# Altium schematic sheet Sheet1.SchDoc
size A4
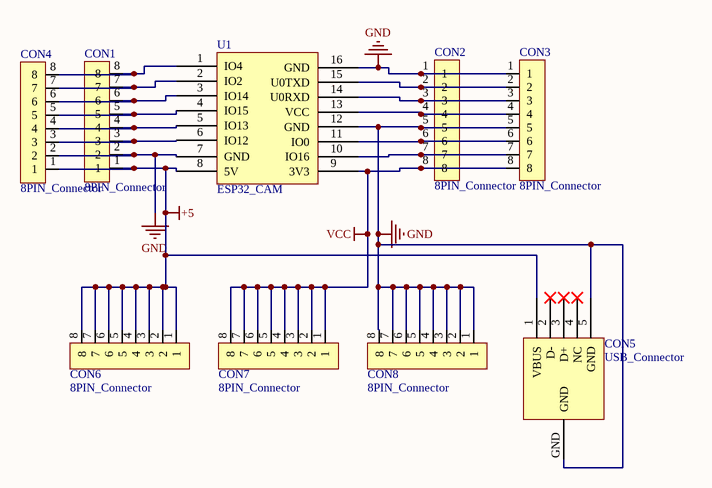
[diagram p0: Sheet1.SchDoc]

## Parts
CON1  8PIN_Connector  [8PIN]
CON2  8PIN_Connector  [8PIN]
CON3  8PIN_Connector  [8PIN]
CON4  8PIN_Connector  [8PIN]
CON5  USB_Connector  [MicroUSB]
CON6  8PIN_Connector  [8PIN_2]
CON7  8PIN_Connector  [8PIN_2]
CON8  8PIN_Connector  [8PIN_2]
U1  ESP32_CAM  [ESPCAM_BOARD]

## Nets
+5: CON1.1 CON4.1 CON5.1(VBUS) CON6.1 CON6.2 CON6.3 CON6.4 CON6.5 CON6.6 CON6.7 CON6.8 U1.8(5V)
GND: CON1.2 CON2.1 CON2.5 CON3.1 CON3.5 CON4.2 CON5.5(GND) CON5.GND CON8.1 CON8.2 CON8.3 CON8.4 CON8.5 CON8.6 CON8.7 CON8.8 U1.7(GND) U1.12(GND) U1.16(GND)
VCC: CON2.8 CON3.8 CON7.1 CON7.2 CON7.3 CON7.4 CON7.5 CON7.6 CON7.7 CON7.8 U1.9(3V3)
NetCON1_3: CON1.3 CON4.3 U1.6(IO12)
NetCON1_4: CON1.4 CON4.4 U1.5(IO13)
NetCON1_5: CON1.5 CON4.5 U1.4(IO15)
NetCON1_6: CON1.6 CON4.6 U1.3(IO14)
NetCON1_7: CON1.7 CON4.7 U1.2(IO2)
NetCON1_8: CON1.8 CON4.8 U1.1(IO4)
NetCON2_2: CON2.2 CON3.2 U1.15(U0TXD)
NetCON2_3: CON2.3 CON3.3 U1.14(U0RXD)
NetCON2_4: CON2.4 CON3.4 U1.13(VCC)
NetCON2_6: CON2.6 CON3.6 U1.11(IO0)
NetCON2_7: CON2.7 CON3.7 U1.10(IO16)

Not connected (* = marked no-connect by the designer): CON5 2(D-)* 3(D+)* 4(NC)*